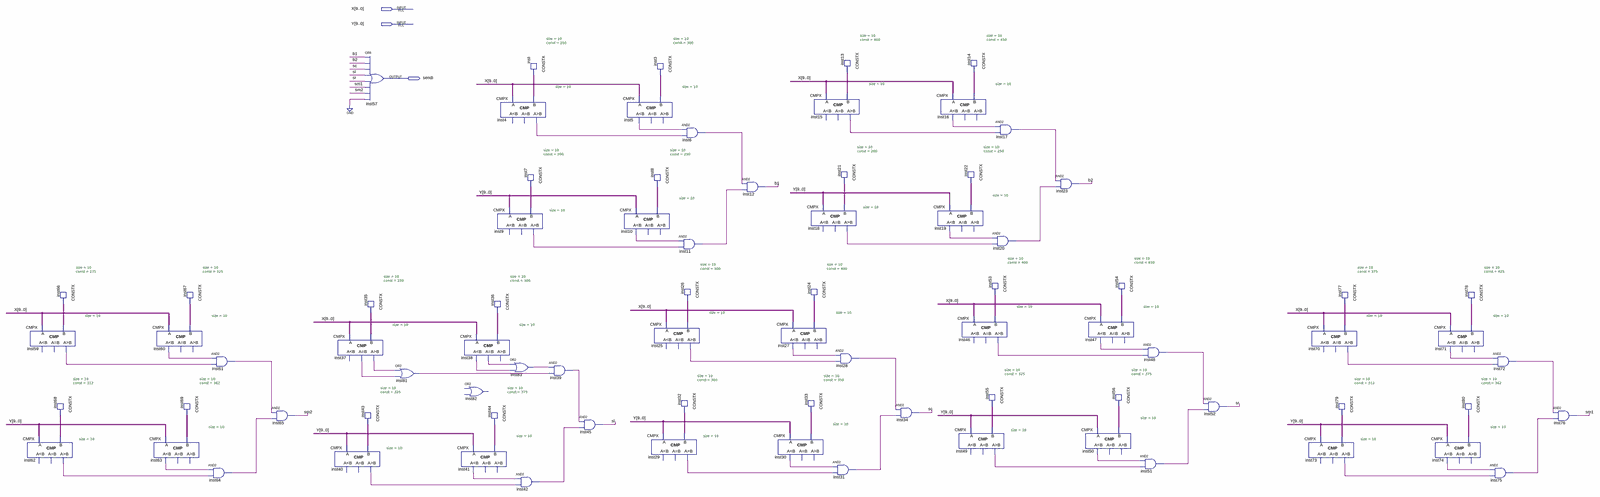
[diagram p0: schematic sheet, whole]
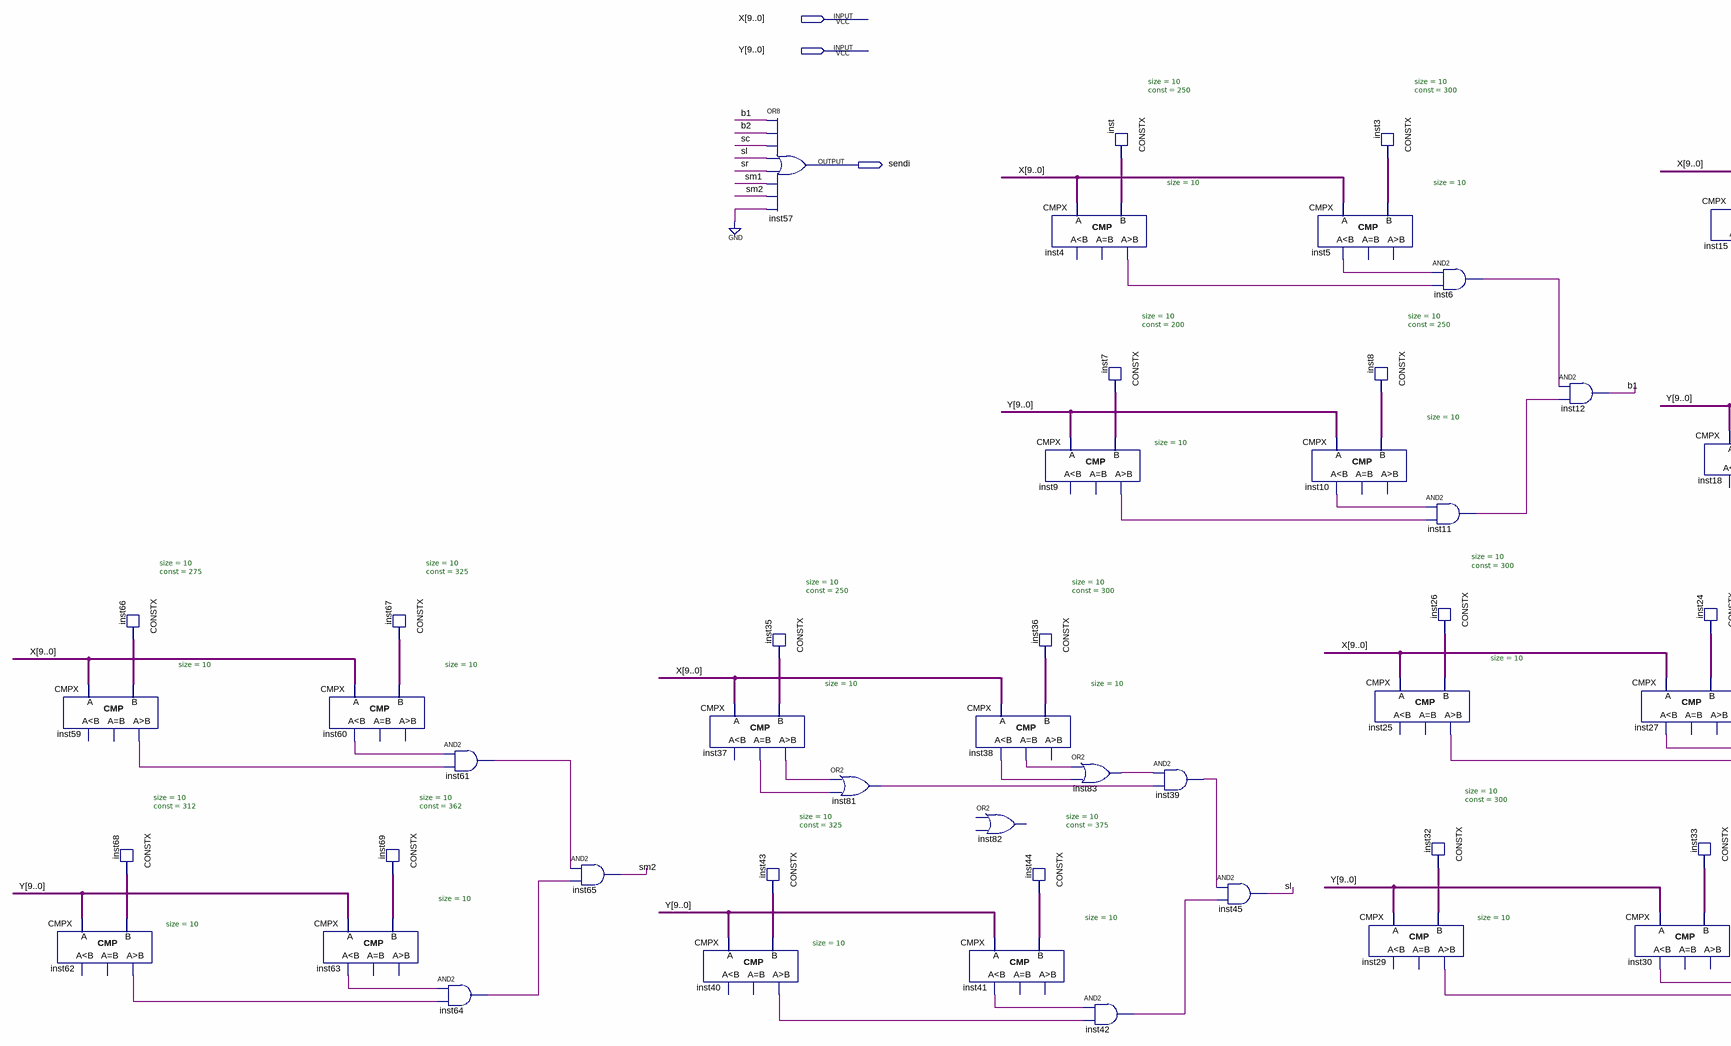
[diagram p1: schematic sheet, left part]
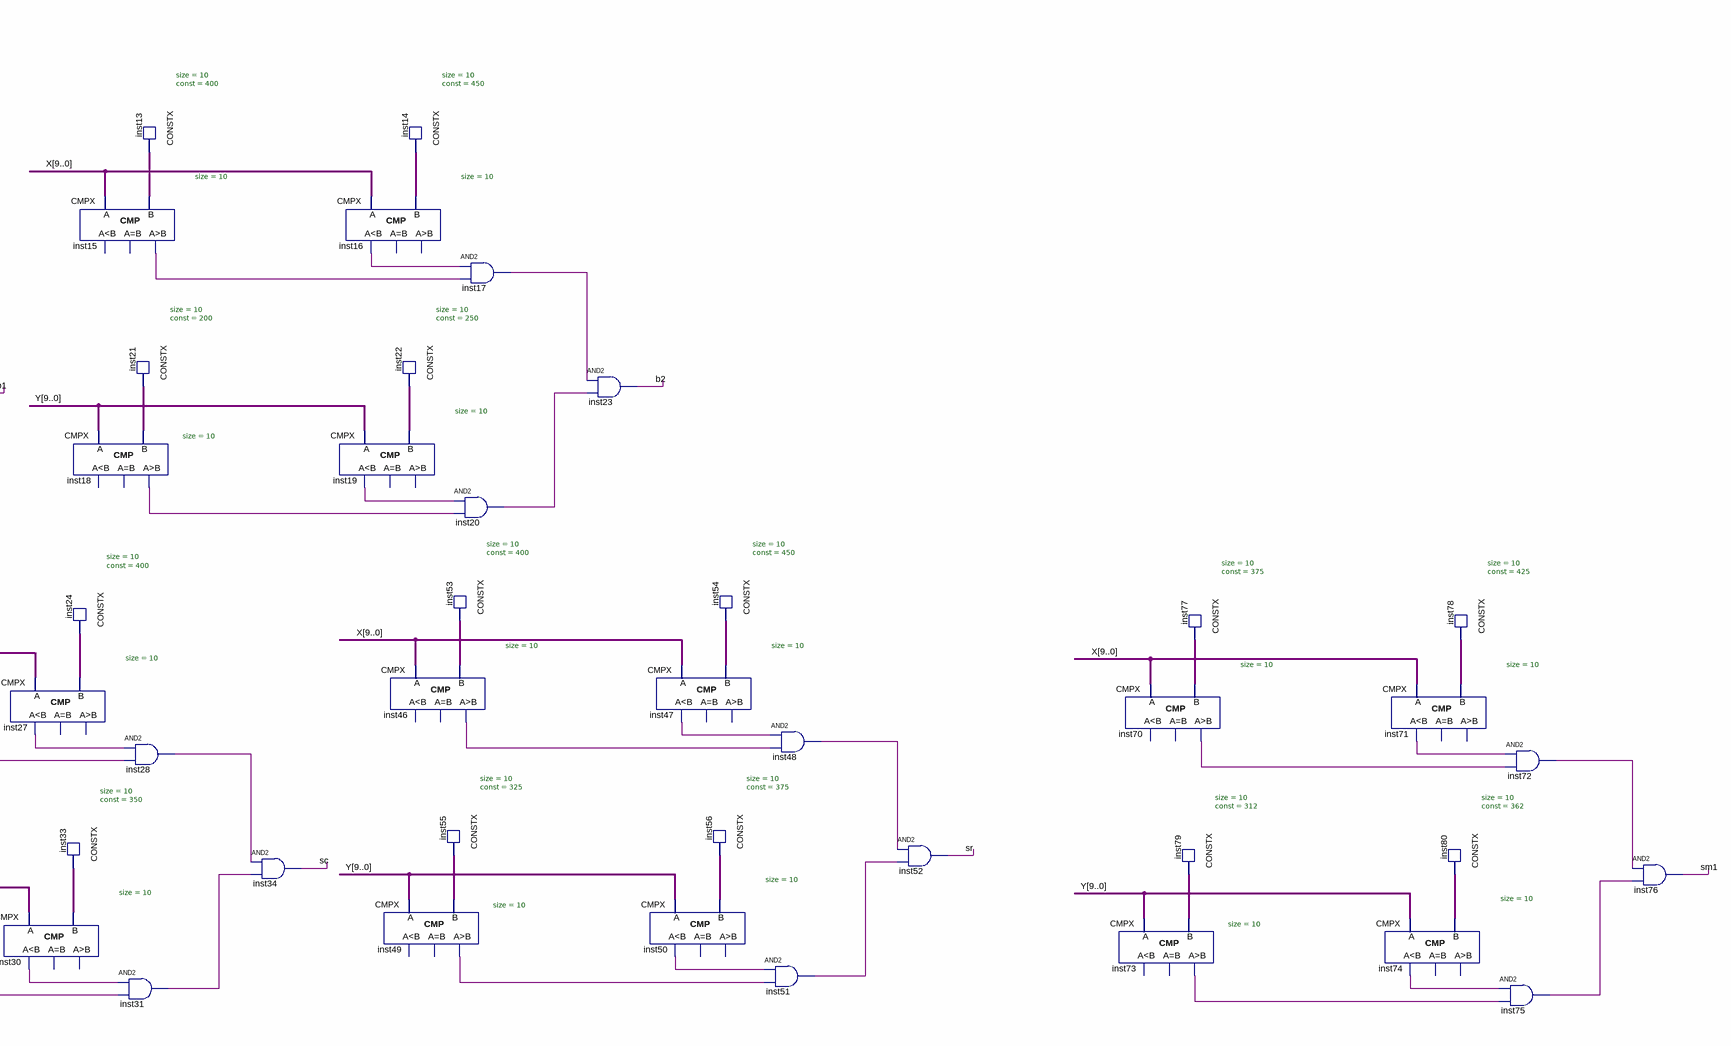
[diagram p2: schematic sheet, right part]
// Quartus schematic Sendi.bdf as structural Verilog: 81 symbols, 3 pins
module Sendi (
  input  [9:0] X,
  input  [9:0] Y,
  output sendi
);

  wire b1, b2, inst4_gr, inst5_ls, inst6_out, inst9_gr, inst10_ls, inst11_out, inst15_gr, inst16_ls,
       inst17_out, inst18_gr, inst19_ls, inst20_out, inst25_gr, inst27_ls, inst28_out, inst29_gr, inst30_ls,
       inst31_out, inst37_eq, inst37_gr, inst38_eq, inst38_ls, inst39_out, inst40_gr, inst41_ls, inst42_out,
       inst46_gr, inst47_ls, inst48_out, inst49_gr, inst50_ls, inst51_out, inst59_gr, inst60_ls, inst61_out,
       inst62_gr, inst63_ls, inst64_out, inst70_gr, inst71_ls, inst72_out, inst73_gr, inst74_ls, inst75_out,
       inst81_out, inst83_out, sc, sl, sm1, sm2, sr;
  wire [9:0] inst3_data, inst7_data, inst8_data, inst13_data, inst14_data, inst21_data, inst22_data,
       inst24_data, inst26_data, inst32_data, inst33_data, inst35_data, inst36_data, inst43_data,
       inst44_data, inst53_data, inst54_data, inst55_data, inst56_data, inst66_data, inst67_data,
       inst68_data, inst69_data, inst77_data, inst78_data, inst79_data, inst80_data, inst_data;

  CMPX #(.size(10)) inst59 (.A(X), .B(inst66_data), .gr(inst59_gr));  // open: ls, eq
  CMPX #(.size(10)) inst62 (.A(Y), .B(inst68_data), .gr(inst62_gr));  // open: ls, eq
  CONSTX #(.size(10), .\const (275)) inst66 (.data(inst66_data));
  CONSTX #(.size(10), .\const (312)) inst68 (.data(inst68_data));
  CMPX #(.size(10)) inst60 (.A(X), .B(inst67_data), .ls(inst60_ls));  // open: eq, gr
  CMPX #(.size(10)) inst63 (.A(Y), .B(inst69_data), .ls(inst63_ls));  // open: eq, gr
  CONSTX #(.size(10), .\const (325)) inst67 (.data(inst67_data));
  CONSTX #(.size(10), .\const (362)) inst69 (.data(inst69_data));
  and inst61 (inst61_out, inst60_ls, inst59_gr);
  and inst64 (inst64_out, inst63_ls, inst62_gr);
  and inst65 (sm2, inst61_out, inst64_out);
  CMPX #(.size(10)) inst37 (.A(X), .B(inst35_data), .eq(inst37_eq), .gr(inst37_gr));  // open: ls
  CMPX #(.size(10)) inst40 (.A(Y), .B(inst43_data), .gr(inst40_gr));  // open: ls, eq
  or inst57 (sendi, b1, b2, sc, sl, sr, sm1, sm2, 1'b0);
  CONSTX #(.size(10), .\const (250)) inst35 (.data(inst35_data));
  CONSTX #(.size(10), .\const (325)) inst43 (.data(inst43_data));
  or inst81 (inst81_out, inst37_gr, inst37_eq);
  CMPX #(.size(10)) inst38 (.A(X), .B(inst36_data), .ls(inst38_ls), .eq(inst38_eq));  // open: gr
  // OR2 inst82 is placed but not wired
  CMPX #(.size(10)) inst41 (.A(Y), .B(inst44_data), .ls(inst41_ls));  // open: eq, gr
  CMPX #(.size(10)) inst4 (.A(X), .B(inst_data), .gr(inst4_gr));  // open: ls, eq
  CMPX #(.size(10)) inst9 (.A(Y), .B(inst7_data), .gr(inst9_gr));  // open: ls, eq
  CONSTX #(.size(10), .\const (300)) inst36 (.data(inst36_data));
  CONSTX #(.size(10), .\const (375)) inst44 (.data(inst44_data));
  or inst83 (inst83_out, inst38_eq, inst38_ls);
  and inst42 (inst42_out, inst41_ls, inst40_gr);
  CONSTX #(.size(10), .\const (250)) inst (.data(inst_data));
  CONSTX #(.size(10), .\const (200)) inst7 (.data(inst7_data));
  and inst39 (inst39_out, inst83_out, inst81_out);
  and inst45 (sl, inst39_out, inst42_out);
  CMPX #(.size(10)) inst5 (.A(X), .B(inst3_data), .ls(inst5_ls));  // open: eq, gr
  CMPX #(.size(10)) inst10 (.A(Y), .B(inst8_data), .ls(inst10_ls));  // open: eq, gr
  CONSTX #(.size(10), .\const (300)) inst3 (.data(inst3_data));
  CONSTX #(.size(10), .\const (250)) inst8 (.data(inst8_data));
  CMPX #(.size(10)) inst25 (.A(X), .B(inst26_data), .gr(inst25_gr));  // open: ls, eq
  CMPX #(.size(10)) inst29 (.A(Y), .B(inst32_data), .gr(inst29_gr));  // open: ls, eq
  and inst6 (inst6_out, inst5_ls, inst4_gr);
  and inst11 (inst11_out, inst10_ls, inst9_gr);
  CONSTX #(.size(10), .\const (300)) inst26 (.data(inst26_data));
  CONSTX #(.size(10), .\const (300)) inst32 (.data(inst32_data));
  and inst12 (b1, inst6_out, inst11_out);
  CMPX #(.size(10)) inst27 (.A(X), .B(inst24_data), .ls(inst27_ls));  // open: eq, gr
  CMPX #(.size(10)) inst30 (.A(Y), .B(inst33_data), .ls(inst30_ls));  // open: eq, gr
  CMPX #(.size(10)) inst15 (.A(X), .B(inst13_data), .gr(inst15_gr));  // open: ls, eq
  CMPX #(.size(10)) inst18 (.A(Y), .B(inst21_data), .gr(inst18_gr));  // open: ls, eq
  CONSTX #(.size(10), .\const (400)) inst24 (.data(inst24_data));
  CONSTX #(.size(10), .\const (350)) inst33 (.data(inst33_data));
  and inst31 (inst31_out, inst30_ls, inst29_gr);
  CONSTX #(.size(10), .\const (400)) inst13 (.data(inst13_data));
  CONSTX #(.size(10), .\const (200)) inst21 (.data(inst21_data));
  and inst28 (inst28_out, inst27_ls, inst25_gr);
  and inst34 (sc, inst28_out, inst31_out);
  CMPX #(.size(10)) inst16 (.A(X), .B(inst14_data), .ls(inst16_ls));  // open: eq, gr
  CMPX #(.size(10)) inst19 (.A(Y), .B(inst22_data), .ls(inst19_ls));  // open: eq, gr
  CMPX #(.size(10)) inst49 (.A(Y), .B(inst55_data), .gr(inst49_gr));  // open: ls, eq
  CONSTX #(.size(10), .\const (450)) inst14 (.data(inst14_data));
  CONSTX #(.size(10), .\const (250)) inst22 (.data(inst22_data));
  CMPX #(.size(10)) inst46 (.A(X), .B(inst53_data), .gr(inst46_gr));  // open: ls, eq
  and inst17 (inst17_out, inst16_ls, inst15_gr);
  and inst20 (inst20_out, inst19_ls, inst18_gr);
  CONSTX #(.size(10), .\const (400)) inst53 (.data(inst53_data));
  CONSTX #(.size(10), .\const (325)) inst55 (.data(inst55_data));
  and inst23 (b2, inst17_out, inst20_out);
  CMPX #(.size(10)) inst47 (.A(X), .B(inst54_data), .ls(inst47_ls));  // open: eq, gr
  CMPX #(.size(10)) inst50 (.A(Y), .B(inst56_data), .ls(inst50_ls));  // open: eq, gr
  CONSTX #(.size(10), .\const (450)) inst54 (.data(inst54_data));
  CONSTX #(.size(10), .\const (375)) inst56 (.data(inst56_data));
  and inst48 (inst48_out, inst47_ls, inst46_gr);
  and inst51 (inst51_out, inst50_ls, inst49_gr);
  and inst52 (sr, inst48_out, inst51_out);
  CMPX #(.size(10)) inst70 (.A(X), .B(inst77_data), .gr(inst70_gr));  // open: ls, eq
  CMPX #(.size(10)) inst73 (.A(Y), .B(inst79_data), .gr(inst73_gr));  // open: ls, eq
  CONSTX #(.size(10), .\const (375)) inst77 (.data(inst77_data));
  CONSTX #(.size(10), .\const (312)) inst79 (.data(inst79_data));
  CMPX #(.size(10)) inst71 (.A(X), .B(inst78_data), .ls(inst71_ls));  // open: eq, gr
  CMPX #(.size(10)) inst74 (.A(Y), .B(inst80_data), .ls(inst74_ls));  // open: eq, gr
  CONSTX #(.size(10), .\const (362)) inst80 (.data(inst80_data));
  CONSTX #(.size(10), .\const (425)) inst78 (.data(inst78_data));
  and inst72 (inst72_out, inst71_ls, inst70_gr);
  and inst75 (inst75_out, inst74_ls, inst73_gr);
  and inst76 (sm1, inst72_out, inst75_out);
endmodule
